# EAGLE design RedBot (EAGLE 6.5.0)
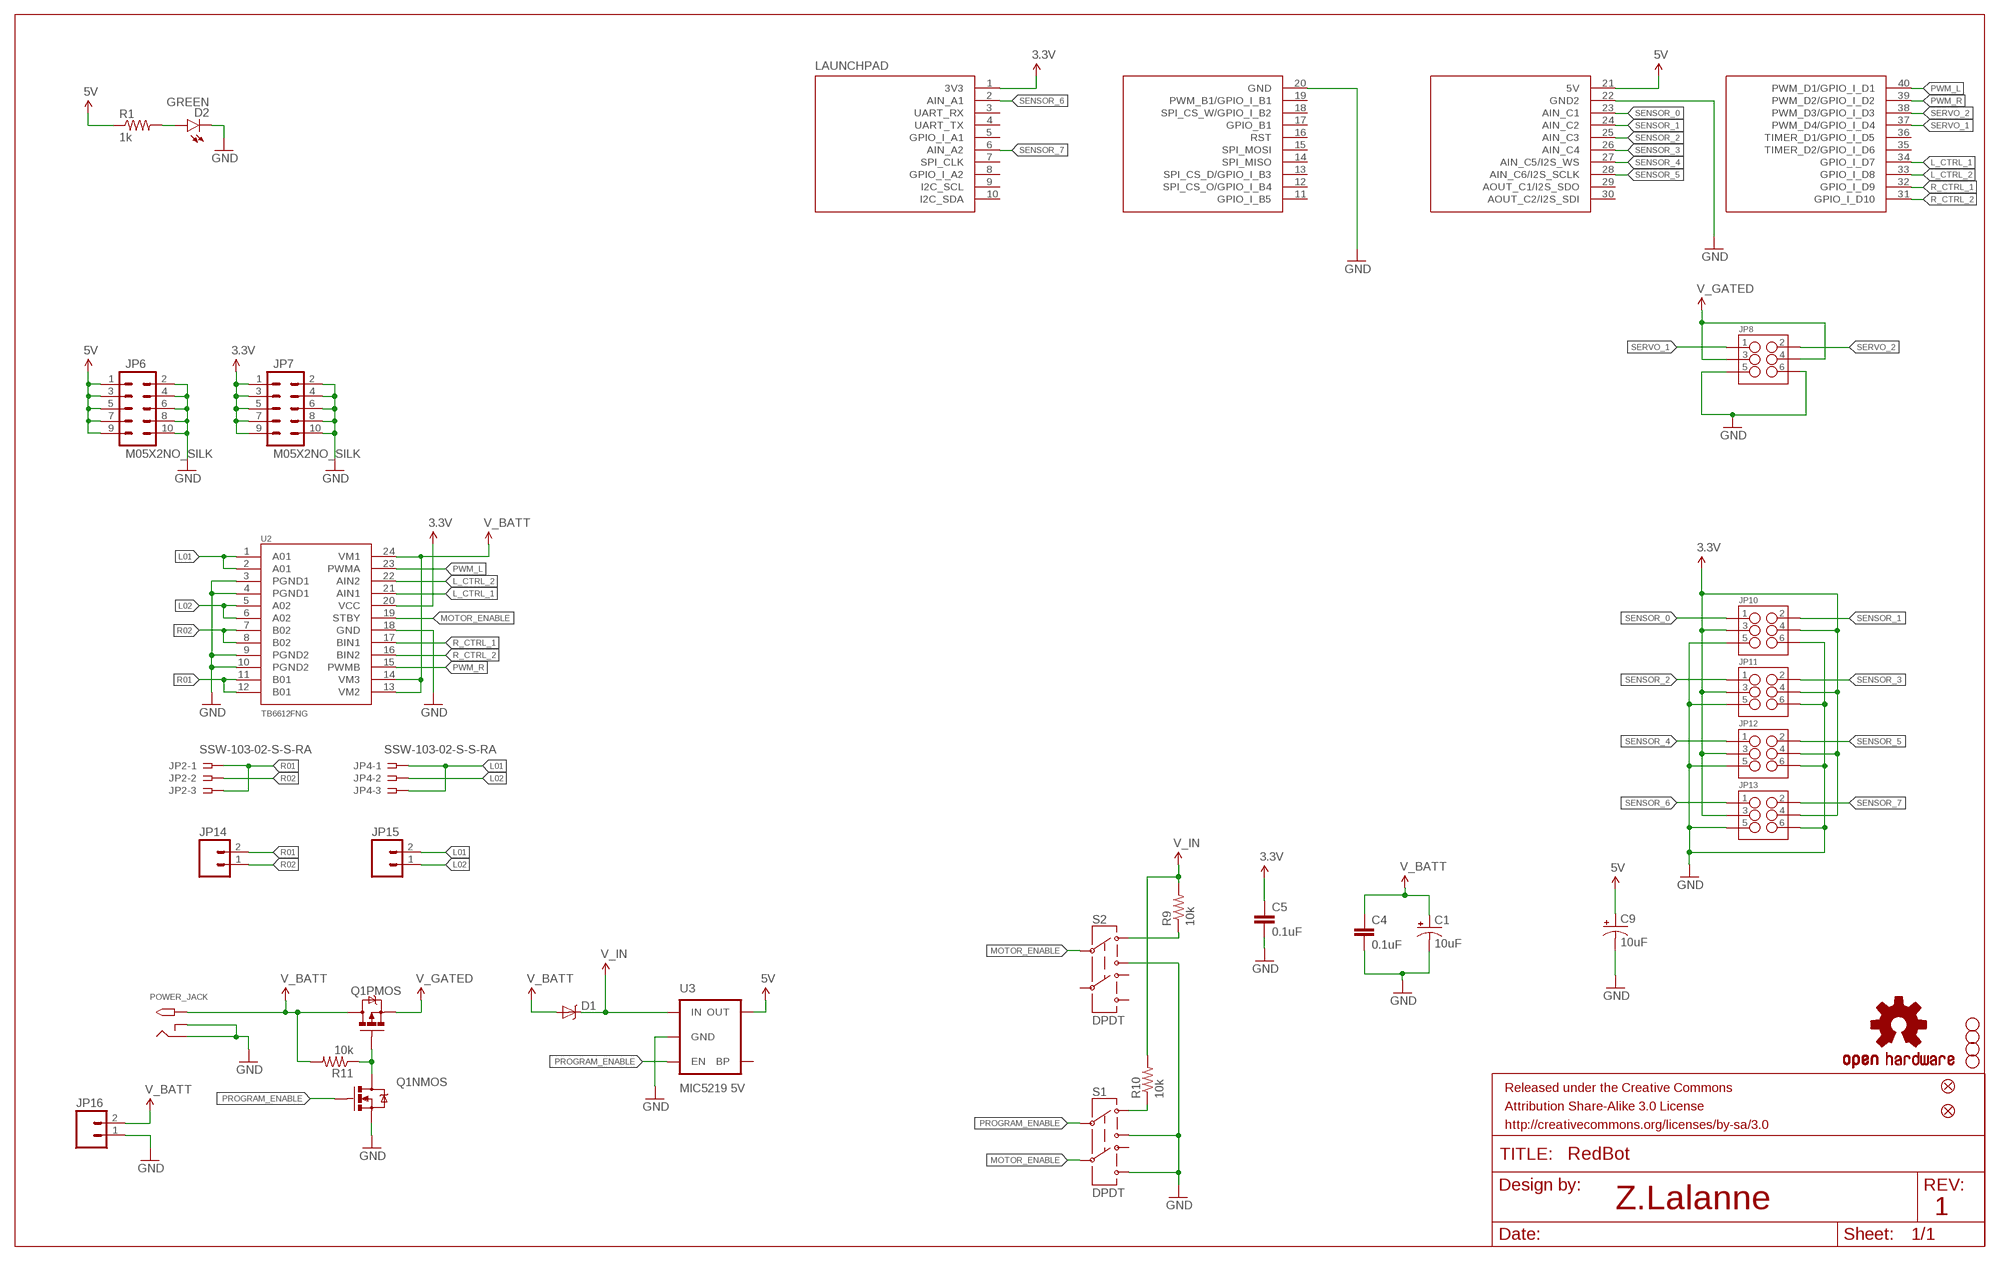
[diagram p0: schematic, sheet 1]

## Parts
C1  10uF  10UF-16V-10%(TANT)  [EIA3216]
C4  0.1uF  CAP1206  [1206]
C5  0.1uF  CAP1206  [1206]
C9  10uF  10UF-16V-10%(TANT)  [EIA3216]
D1  B340A  [SMA-DIODE]
D2  GREEN  LED-GREENLARGE  [LED-1206]
FID1  FIDUCIALUFIDUCIAL  [MICRO-FIDUCIAL]
FID2  FIDUCIALUFIDUCIAL  [MICRO-FIDUCIAL]
FRAME1  FRAME-LETTER  [CREATIVE_COMMONS]
JP2  SSW-103-02-S-S-RA  [SSW-103-02-S-S-RA]
JP4  SSW-103-02-S-S-RA  [SSW-103-02-S-S-RA]
JP6  M05X2NO_SILK  [2X5_NOSILK]
JP7  M05X2NO_SILK  [2X5_NOSILK]
JP8  M03X22X3_SILK_SM  [2X3]
JP10  M03X22X3_SILK_SM  [2X3]
JP11  M03X22X3_SILK_SM  [2X3]
JP12  M03X22X3_SILK_SM  [2X3]
JP13  M03X22X3_SILK_SM  [2X3]
JP14  M02PTH  [1X02]
JP15  M02PTH  [1X02]
JP16  M02PTH  [1X02]
LAUNCHPAD  BOOSTERPACK  [BOOSTERPACK40]
POWER_JACK  2.1MMJACKTHM  [PJ-102A]
Q1  IRF7509  [MSOP8]
R1  1k  RESISTOR1206  [1206]
R9  10k  RESISTOR1206  [1206]
R10  10k  RESISTOR1206  [1206]
R11  10k  RESISTOR1206  [1206]
S1  DPDT  SWITCH-DPDTAYZ0202  [AYZ0202]
S2  DPDT  SWITCH-DPDTAYZ0202  [AYZ0202]
STANDOFF1  STAND-OFF  [STAND-OFF]
STANDOFF2  STAND-OFF  [STAND-OFF]
STANDOFF3  STAND-OFF  [STAND-OFF]
STANDOFF4  STAND-OFF  [STAND-OFF]
U2  TB6612FNG  TB6621FNG  [SSOP24]
U3  MIC5219 5V  V_REG_MIC52195V  [SOT23-5]
U$17  OSHW-LOGOS  [OSHW-LOGO-S]

## Nets
3.3V: C5.1 JP7.1 JP7.3 JP7.5 JP7.7 JP7.9 JP10.3 JP10.4 JP11.3 JP11.4 JP12.3 JP12.4 JP13.3 JP13.4 LAUNCHPAD.1(3V3) U2.20(VCC)
5V: C9.A(+) JP6.1 JP6.3 JP6.5 JP6.7 JP6.9 LAUNCHPAD.21(5V) R1.1 U3.5(OUT)
GND: C1.C(-) C4.2 C5.2 C9.C(-) D2.C JP6.2 JP6.4 JP6.6 JP6.8 JP6.10 JP7.2 JP7.4 JP7.6 JP7.8 JP7.10 JP8.5 JP8.6 JP10.5 JP10.6 JP11.5 JP11.6 JP12.5 JP12.6 JP13.5 JP13.6 JP16.1 LAUNCHPAD.20(GND) LAUNCHPAD.22(GND2) POWER_JACK.RING POWER_JACK.RING_SW Q1.1(NMOS:S) S1.3 S1.6 S2.3 U2.3(PGND1) U2.4(PGND1) U2.9(PGND2) U2.10(PGND2) U2.18(GND) U3.2(GND)
L01: JP4.1 JP4.3 JP15.2 U2.1(A01) U2.2(A01)
L02: JP4.2 JP15.1 U2.5(A02) U2.6(A02)
L_CTRL_1: LAUNCHPAD.34(GPIO_I_D7) U2.21(AIN1)
L_CTRL_2: LAUNCHPAD.33(GPIO_I_D8) U2.22(AIN2)
MOTOR_ENABLE: S1.5 S2.2 U2.19(STBY)
N$1: D2.A R1.2
N$2: Q1.4(PMOS:G) Q1.7(NMOS:D) Q1.8(NMOS:D) R11.1
N$18: R9.1 S2.1
PG_EN: R10.1 S1.1
PROGRAM_ENABLE: Q1.2(NMOS:G) S1.2 U3.3(EN)
PWM_L: LAUNCHPAD.40(PWM_D1/GPIO_I_D1) U2.23(PWMA)
PWM_R: LAUNCHPAD.39(PWM_D2/GPIO_I_D2) U2.15(PWMB)
R01: JP2.1 JP2.3 JP14.2 U2.11(B01) U2.12(B01)
R02: JP2.2 JP14.1 U2.7(B02) U2.8(B02)
R_CTRL_1: LAUNCHPAD.32(GPIO_I_D9) U2.17(BIN1)
R_CTRL_2: LAUNCHPAD.31(GPIO_I_D10) U2.16(BIN2)
SENSOR_0: JP10.1 LAUNCHPAD.23(AIN_C1)
SENSOR_1: JP10.2 LAUNCHPAD.24(AIN_C2)
SENSOR_2: JP11.1 LAUNCHPAD.25(AIN_C3)
SENSOR_3: JP11.2 LAUNCHPAD.26(AIN_C4)
SENSOR_4: JP12.1 LAUNCHPAD.27(AIN_C5/I2S_WS)
SENSOR_5: JP12.2 LAUNCHPAD.28(AIN_C6/I2S_SCLK)
SENSOR_6: JP13.1 LAUNCHPAD.2(AIN_A1)
SENSOR_7: JP13.2 LAUNCHPAD.6(AIN_A2)
SERVO_1: JP8.1 LAUNCHPAD.37(PWM_D4/GPIO_I_D4)
SERVO_2: JP8.2 LAUNCHPAD.38(PWM_D3/GPIO_I_D3)
V_BATT: C1.A(+) C4.1 D1.A JP16.2 POWER_JACK.TIP Q1.5(PMOS:D) Q1.6(PMOS:D) R11.2 U2.13(VM2) U2.14(VM3) U2.24(VM1)
V_GATED: JP8.3 JP8.4 Q1.3(PMOS:S)
V_IN: D1.C R9.2 R10.2 U3.1(IN)
Unconnected: LAUNCHPAD.3(UART_RX) LAUNCHPAD.4(UART_TX) LAUNCHPAD.5(GPIO_I_A1) LAUNCHPAD.7(SPI_CLK) LAUNCHPAD.8(GPIO_I_A2) LAUNCHPAD.9(I2C_SCL) LAUNCHPAD.10(I2C_SDA) LAUNCHPAD.11(GPIO_I_B5) LAUNCHPAD.12(SPI_CS_O/GPIO_I_B4) LAUNCHPAD.13(SPI_CS_D/GPIO_I_B3) LAUNCHPAD.14(SPI_MISO) LAUNCHPAD.15(SPI_MOSI) LAUNCHPAD.16(RST) LAUNCHPAD.17(GPIO_B1) LAUNCHPAD.18(SPI_CS_W/GPIO_I_B2) LAUNCHPAD.19(PWM_B1/GPIO_I_B1) LAUNCHPAD.29(AOUT_C1/I2S_SDO) LAUNCHPAD.30(AOUT_C2/I2S_SDI) LAUNCHPAD.35(TIMER_D2/GPIO_I_D6) LAUNCHPAD.36(TIMER_D1/GPIO_I_D5) S1.4 S2.4 S2.5 S2.6 U3.4(BP)

## Notes on the sheet
- Z.Lalanne | 1

## Library data of the parts
C1 C9 = SparkFun-Capacitors:10UF-16V-10%(TANT): CAP-00811 1206/EIA-3216 Tantalum capacitor; PROD_ID: CAP-00811
C4 C5 = SparkFun-Capacitors:CAP: Capacitor Standard 0603 ceramic capacitor, and 0.1" leaded capacitor.
D1 = SparkFun-DiscreteSemi:B340A: Schottky Diode 3A-40V; PROD_ID: DIO-09886
D2 = SparkFun-LED:LED-GREEN: Various green LEDs Green LEDs used in SFE Production 0603- DIO-00821 LARGE- DIO-00862 LILYPAD- DIO-09910; PROD_ID: DIO-00862
FID1 FID2 = SparkFun-Aesthetics:FIDUCIAL: Fiducial Alignment Points Various fiducial points for machine vision alignment.
FRAME1 = SparkFun-Aesthetics:FRAME-LETTER: Schematic Frame Standard 8.5x11 US Letter frame
JP2 JP4 = con-samtec:SSW-103-02-S-S: THROUGH-HOLE .025" SQ POST SOCKET Source: Samtec SSW.pdf; MPN: SSW-103-02-S-S-RA; OC_FARNELL: unknown; OC_NEWARK: 11P9368
JP6 JP7 = SparkFun-Connectors:M05X2: Header 5x2 Standard 10-pin dual row 0.1" header. Commonly used with AVR-ISP. Use with Spark Fun Electronics SKU: PRT-00778
JP8 JP10-JP13 = SparkFun-Connectors:M03X2: 2x3 .1" header. Shrouded, with keying- CONN-10681 SMT- CONN-11415 Pogo pins- HW-11044
JP14-JP16 = SparkFun-Connectors:M02: Header 2 Standard 2-pin 0.1" header. Use with straight break away headers (SKU : PRT-00116), right angle break away headers (PRT-00553), swiss pins (PRT-00743), machine pins (PRT-00117), and female headers (PRT-00115). Molex polarized connector foot print use with SKU : PRT-08233 with associated crimp pins and housings.
LAUNCHPAD = zlalanne:BOOSTERPACK
POWER_JACK = adafruit:2.1MMJACK: 2.1mm x 5.5mm THM DC jack with internal switch. Digikey part #PJ-102A, 4UCON part #05537 2.1mm x 5.5mm SMT DC jack with internal switch. Digikey part #PJ-002A-SMT, 4UCON part #03267 By microbuilder.eu & adafruit.com
Q1 = SparkFun-DiscreteSemi:IRF7509: 30V Dual PMOS/NMOS MSOP-8 NMOS RDS .11-ohm PMOS RDS .20-ohm TRANS-07913; PROD_ID: TRANS-07913
R1 R9-R11 = SparkFun-Resistors:RESISTOR: Resistor Basic schematic elements and footprints for 0603, 1206, and PTH resistors.
S1 S2 = SparkFun-Electromechanical:SWITCH-DPDT: DPDT Version of the COM-00597; PROD_ID: SWCH-08179
STANDOFF1-STANDOFF4 = SparkFun-Electromechanical:STAND-OFF: #4 Stand Off This is the mechanical footprint for a #4 phillips button head screw. Use the keepout ring to avoid running the screw head into surrounding components. SKU : PRT-00447
U2 = SparkFun-PowerIC:TB6621FNG: Toshiba 1A dual motor driver IC-09363; PROD_ID: IC-09363
U3 = SparkFun-PowerIC:V_REG_MIC5219: V_REG MIC5219 Standard 500mA LDO voltage regulator in SOT-23 layout. Micrel part MIC5219. BP (by-pass) pin is used to lower output noise with 470pF cap, may be left open.; PROD_ID: VREG-10107
U$17 = SparkFun-Aesthetics:OSHW-LOGO: Open Source Hardware Logo This logo indicates the piece of hardware it is found on incorporates a OSHW license and/or adheres to the definition of open source hardware found here: http://freedomdefined.org/OSHW

## Board
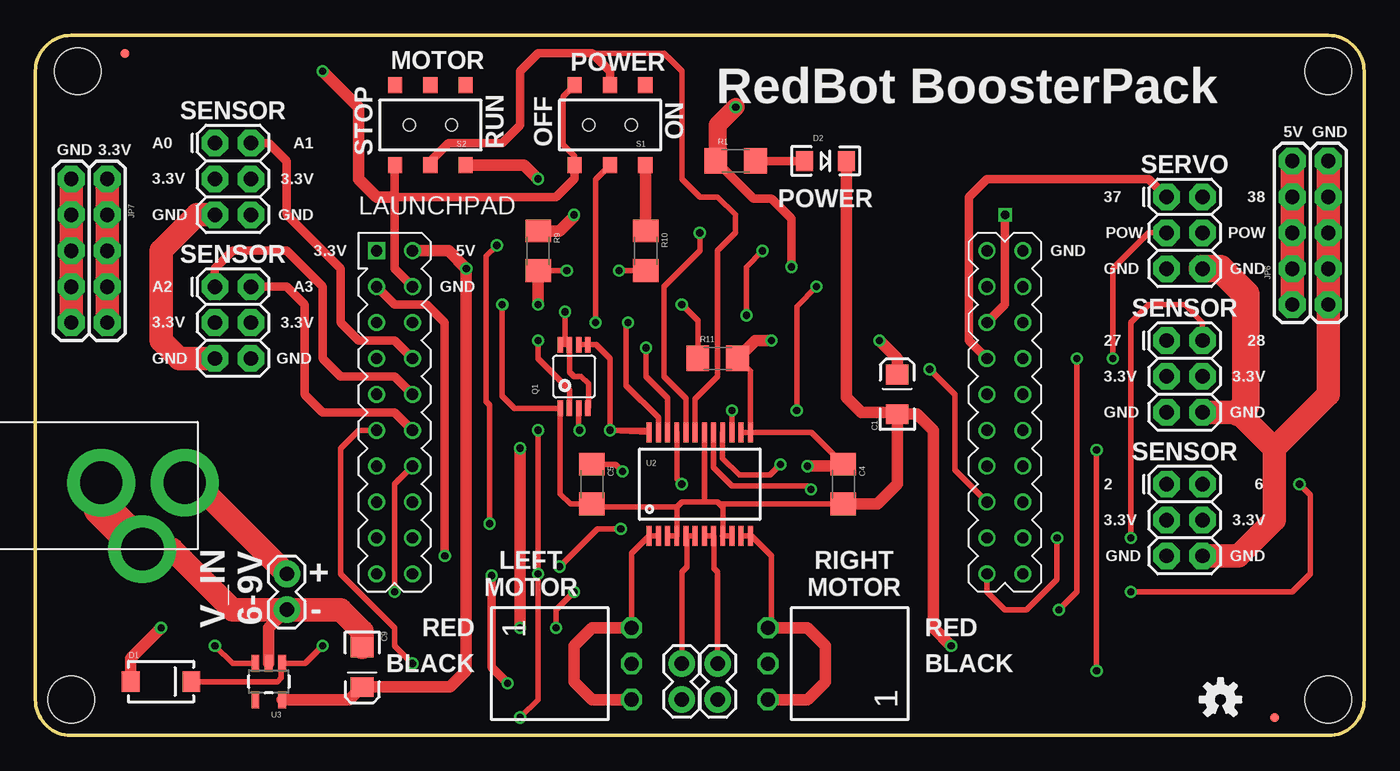
[diagram p1: board, top side]
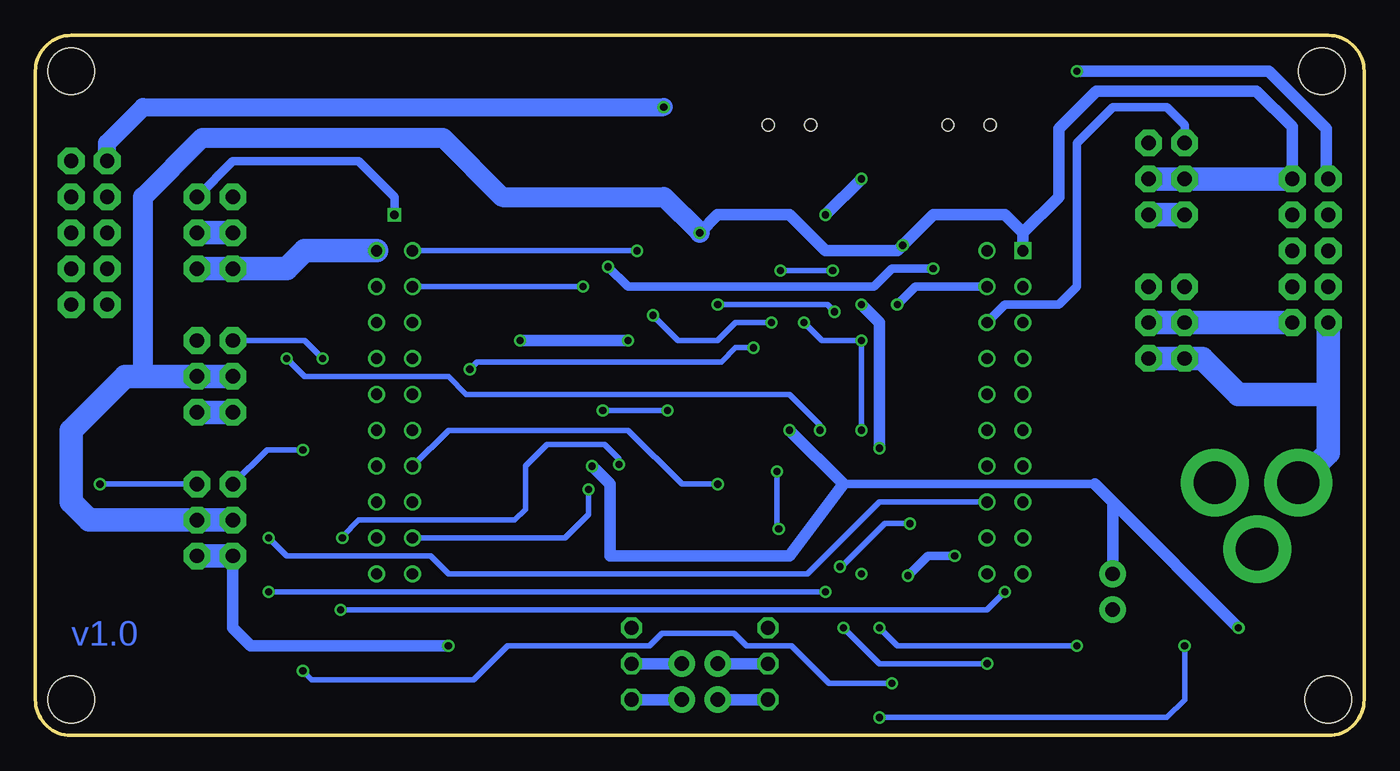
[diagram p2: board, bottom side, seen from below]

Size 93.98 x 49.53 mm. Coordinates in mm from the lower left corner, seen from the top.
Outline: 0,46.99 0,2.54 arc90 2.54,0 91.44,0 arc90 93.98,2.54 93.98,46.99 arc90 91.44,49.53 2.54,49.53 arc90 0,46.99
Copper layers (1*16): Top 0.0356mm / dielectric 1.5011mm / Bottom 0.0356mm
Design rules "LaenPCBOrder": minimum track width 6mil, minimum drill 13mil, track to track 6mil, track to pad 6mil, pad to pad 6mil, via to via 6mil, smd to smd 6mil, copper to edge 15mil, drill to drill 6mil, minimum pad ring 7mil, minimum via ring 7mil, stop-mask expansion 3mil, vias tented up to drill 0mil, thermal gap 10mil

### Footprints (pad centres in the part's own frame; a part is rotated, then mirrored left to right if it is on the bottom)
EIA3216 = smd 1.4 x 1.6: A 1.4,0; C -1.4,0
1206 = smd 1.6 x 1.8: 1 -1.4,0; 2 1.4,0
SMA-DIODE = smd 1.27 x 1.47: A -2.15,0; C 2.15,0
LED-1206 = smd 1.2 x 1.4: A -1.5,0; C 1.5,0
MICRO-FIDUCIAL = smd 0.635 x 0.635: 1 0,0
SSW-103-02-S-S-RA = drill 1 pad 1.5 octagon: 1 -2.54,1.524; 2 0,1.524; 3 2.54,1.524
2X5_NOSILK = drill 1.016 pad 1.88 octagon: 1 -1.27,5.08; 2 1.27,5.08; 3 -1.27,2.54; 4 1.27,2.54; 5 -1.27,0; 6 1.27,0; 7 -1.27,-2.54; 8 1.27,-2.54; 9 -1.27,-5.08; 10 1.27,-5.08
2X3 = drill 1.016 pad 1.88 octagon: 1 0,0; 2 0,2.54; 3 2.54,0; 4 2.54,2.54; 5 5.08,0; 6 5.08,2.54
1X02 = drill 1.016 pad 1.88: 1 0,0; 2 2.54,0
BOOSTERPACK40 = drill 0.8 square: 1 -22.86,11.43 | drill 0.8: 2 -22.86,8.89; 3 -22.86,6.35; 4 -22.86,3.81; 5 -22.86,1.27; 6 -22.86,-1.27; 7 -22.86,-3.81; 8 -22.86,-6.35; 9 -22.86,-8.89; 10 -22.86,-11.43; 11 22.86,-11.43; 12 22.86,-8.89; 13 22.86,-6.35; 14 22.86,-3.81; 15 22.86,-1.27; 16 22.86,1.27; 17 22.86,3.81; 18 22.86,6.35; 19 22.86,8.89; 20 22.86,11.43; 21 -20.32,11.43; 22 -20.32,8.89; 23 -20.32,6.35; 24 -20.32,3.81; 25 -20.32,1.27; 26 -20.32,-1.27; 27 -20.32,-3.81; 28 -20.32,-6.35; 29 -20.32,-8.89; 30 -20.32,-11.43; 31 20.32,-11.43; 32 20.32,-8.89; 33 20.32,-6.35; 34 20.32,-3.81; 35 20.32,-1.27; 36 20.32,1.27; 37 20.32,3.81; 38 20.32,6.35; 39 20.32,8.89; 40 20.32,11.43
PJ-102A = drill 3 pad 4.8: RING 0.1,-3.39; RING_SW -4.6,-6.29; TIP 0.1,-9.29
MSOP8 = smd 0.4 x 1.1: 1 -0.975,-2.25; 2 -0.325,-2.25; 3 0.325,-2.25; 4 0.975,-2.25; 5 0.975,2.25; 6 0.325,2.25; 7 -0.325,2.25; 8 -0.975,2.25
AYZ0202 = smd 1 x 1.15: 1 -2.5,2.825; 2 0,2.825; 3 2.5,2.825; 4 -2.5,-2.825; 5 0,-2.825; 6 2.5,-2.825 | hole 0.85: 1.5,0; -1.5,0
STAND-OFF = hole 3.302: 0,0
SSOP24 = smd 0.348 x 1.397: 1 -3.575,-3.656; 2 -2.925,-3.656; 3 -2.275,-3.656; 4 -1.625,-3.656; 5 -0.975,-3.656; 6 -0.325,-3.656; 7 0.325,-3.656; 8 0.975,-3.656; 9 1.625,-3.656; 10 2.275,-3.656; 11 2.925,-3.656; 12 3.575,-3.656; 13 3.575,3.656; 14 2.925,3.656; 15 2.275,3.656; 16 1.625,3.656; 17 0.975,3.656; 18 0.325,3.656; 19 -0.325,3.656; 20 -0.975,3.656; 21 -1.625,3.656; 22 -2.275,3.656; 23 -2.925,3.656; 24 -3.575,3.656
SOT23-5 = smd 0.55 x 1.2: 1 -0.95,-1.3; 2 0,-1.3; 3 0.95,-1.3; 4 0.95,1.3; 5 -0.95,1.3

### Placement (x,y rotation side)
C1  60.96,24.13 90 top
C4  57.15,17.78 270 top
C5  39.37,17.78 270 top
C9  23.11,4.83 270 top
D1  8.89,3.81 0 top
D2  55.88,40.64 0 top
FID1  6.35,48.26 0 top
FID2  87.63,1.27 0 top
FRAME1  19.05,-11.43 0 top  (outside the outline)
JP2  53.34,5.08 90 top
JP4  40.64,5.08 270 top
JP6  90.17,35.56 0 top
JP7  3.81,34.29 180 top
JP8  80.01,38.1 270 top
JP10  12.7,41.91 270 top
JP11  12.7,31.75 270 top
JP12  80.01,27.94 270 top
JP13  80.01,17.78 270 top
JP14  48.26,5.08 270 top
JP15  45.72,5.08 270 top
JP16  17.78,8.89 90 top
LAUNCHPAD  46.99,22.86 0 top
POWER_JACK  1.27,17.78 90 top
Q1  38.1,25.4 0 top
R1  49.53,40.64 0 top
R9  35.56,34.29 270 top
R10  43.18,34.29 270 top
R11  48.26,26.67 0 top
S1  40.64,43.18 180 top
S2  27.94,43.18 180 top
STANDOFF1  91.44,2.54 0 top
STANDOFF2  2.99,46.99 0 top
STANDOFF3  2.54,2.54 0 top
STANDOFF4  91.44,46.99 0 top
U2  46.99,17.78 0 top
U3  16.51,3.81 180 top
U$17  83.82,2.54 0 top

### Tracks (layer width: path | path; a pad name or v marks a point on that pad's centre or on a via)
3.3V  (via drill 0.51)
  Top 0.406: v46.99,35.56 46.99,34.29 44.45,31.75 44.45,25.4 46.02,23.84 U2.20 | C5.1 41.02,19.18 v41.53,18.67 | v41.4,14.61 39.75,14.61 v37.08,11.94 | v32.13,14.99 32.13,23.37 31.88,23.62 31.88,33.91 v32.64,34.67
  Top 1.676: JP7.9 JP7.7 JP7.5 JP7.3 JP7.1
  Bottom 0.406: v41.53,18.67 41.53,14.73 v41.4,14.61 | v37.08,11.94 36.96,11.94 33.91,14.99 v32.13,14.99
  Bottom 0.813: LAUNCHPAD.1 24.13,35.56 | 24.13,35.56 25.4,36.83 30.48,36.83 31.75,35.56 v32.64,34.67 33.02,34.29 38.1,34.29 40.64,36.83 45.72,36.83 v46.99,35.56 | 24.13,35.56 21.59,38.1 21.59,42.93 18.92,45.59 7.62,45.59 5.08,43.05 JP7.9
  Bottom 1.422: 86.36,25.4 86.36,38.1 82.17,42.29 65.15,42.29 60.96,38.1 49.53,38.1 v46.99,35.56
  Bottom 1.676: JP13.3 JP13.4 90.17,15.24 91.44,16.51 91.44,21.59 87.63,25.4 86.36,25.4 JP12.4 JP12.3 | JP11.4 JP11.3 JP7.1 | JP10.4 JP10.3 JP7.9
5V  (via drill 0.51)
  Top 0.61: v53.47,33.15 53.47,36.58 52.07,37.97 50.8,37.97 R1.1
  Top 0.813: U3.5 22.2,2.51 C9.A 29.34,3.43 30.48,4.57 v30.48,33.02 29.21,34.29 LAUNCHPAD.21
  Top 1.27: v49.53,44.45 48.26,43.18 48.26,40.77 R1.1
  Top 1.676: JP6.1 JP6.3 JP6.5 JP6.7 JP6.9
  Bottom 0.61: v30.48,33.02 33.4,33.02 34.67,31.75 52.07,31.75 v53.47,33.15
  Bottom 1.27: JP6.1 88.9,41.91 86.36,44.45 v49.53,44.45
GND  (via drill 0.51)
  Top 0.406: U2.3 U2.4 45.37,16.16 | U2.10 U2.9 48.64,14.15 48.64,16.13 48.39,16.38 | 45.37,16.16 45.72,16.51 47.24,16.51 | 47.24,16.51 48.26,16.51 48.39,16.38 | U2.18 47.31,16.58 47.24,16.51 | 45.37,16.16 39.59,16.16 C5.2 37.85,16.38 37.12,17.1 Q1.1 37.09,23.11 33.91,23.11 33.02,24 v33.02,30.48 | C4.2 48.39,16.38 | S1.3 38.14,40.98 37.34,41.78 37.34,45.2 S1.6
  Top 0.61: LAUNCHPAD.22 25.4,33.02 25.4,38.1 | 25.4,38.1 25.4,40.31 S2.3 | S1.3 38.14,39.41 36.83,38.1 25.4,38.1
  Top 0.813: U3.2 16.51,7.62 JP16.1 | C4.2 59.56,16.38 60.96,17.78 C1.C | C1.C 62.36,22.73 63.5,21.59 63.5,7.62 v64.77,6.35 | D2.C 57.38,23.9 58.42,22.86 60.83,22.86 C1.C | 25.4,38.1 24.13,38.1 22.86,39.37 22.86,44.45 v20.32,46.99
  Top 1.676: JP6.2 JP6.4 JP6.6 JP6.8 | JP6.8 JP6.10 | JP7.10 JP7.8 JP7.6 JP7.4 JP7.2 | JP13.6 85.09,12.7 87.63,15.24 87.63,20.32 | 87.63,20.32 85.09,22.86 JP12.6 | JP6.8 91.44,24.13 87.63,20.32 | JP10.5 11.43,36.83 8.89,34.29 8.89,27.94 10.16,26.67 JP11.5 | POWER_JACK.RING_SW 9.68,13.18 13.97,8.89 JP16.1 21.59,8.89 23.11,7.37 C9.C
  Top 1.93: JP8.6 83.82,33.02 85.6,31.24 85.6,23.37 85.09,22.86
  Top 2.54: POWER_JACK.RING 4.66,16.08 POWER_JACK.RING_SW
  Bottom 0.61: LAUNCHPAD.22 31.75,31.75 v33.02,30.48
  Bottom 0.813: v64.77,6.35 78.74,6.35 80.01,7.62 JP13.5 | v20.32,46.99 6.73,46.99 2.67,42.93 2.67,39.5 JP7.10
  Bottom 1.676: JP13.5 JP13.6 | JP12.5 JP12.6 | JP8.6 JP8.5 76.2,33.02 74.93,34.29 LAUNCHPAD.20 | JP11.5 JP11.6 11.43,26.67 8.89,24.13 2.54,24.13 | JP10.5 JP10.6 | JP7.2 2.54,24.13 | 2.54,24.13 2.54,20 POWER_JACK.RING
L01
  Top 0.406: JP4.1 42.16,12.87 U2.1 U2.2
  Top 0.813: JP4.1 39.37,7.62 38.1,6.35 38.1,3.81 39.37,2.54 JP4.3
  Bottom 0.813: JP4.3 JP15.2
L02
  Top 0.406: JP15.1 45.72,11.56 46.1,11.94 46.1,14.04 U2.5 U2.6
  Bottom 0.813: JP4.2 JP15.1
L_CTRL_1  (via drill 0.51)
  Top 0.406: U2.21 45.37,18.14 v45.72,17.78
  Bottom 0.406: v45.72,17.78 48.26,17.78 52.07,21.59 64.77,21.59 LAUNCHPAD.34
L_CTRL_2  (via drill 0.51)
  Top 0.406: U2.22 44.72,23.86 43.18,25.4 v43.18,27.43 | v63.25,25.91 65.02,24.13 65.02,18.8 LAUNCHPAD.33
  Bottom 0.406: v43.18,27.43 44.45,27.43 45.47,26.42 62.74,26.42 v63.25,25.91
MOTOR_ENABLE
  Top 0.406: U2.19 46.66,23.8 48.26,25.4 48.26,34.29 49.53,35.56 49.53,36.83 48.26,38.1 46.99,38.1 45.72,39.37 45.72,46.99 44.45,48.26 39.37,48.26
  Top 0.61: S1.5 40.64,46.99 39.37,48.26 35.56,48.26 34.29,46.99 34.29,43.18 33.02,41.91 29.21,41.91 27.94,40.64 S2.2
N$1
  Top 0.61: D2.A R1.2
N$2  (via drill 0.51)
  Top 0.406: Q1.8 Q1.7 | Q1.7 37.77,25.73 38.1,25.4 38.61,25.4 39.12,24.89 39.12,23.19 Q1.4 | R11.1 46.86,29.34 v45.72,30.48 | v37.47,29.97 37.47,27.96 Q1.7
  Bottom 0.406: v45.72,30.48 37.97,30.48 v37.47,29.97
N$18  (via drill 0.51)
  Top 0.813: S2.1 34.58,40.35 v35.56,39.37 | v38.1,36.83 38.1,36.7 37.08,35.69 R9.1
  Bottom 0.813: v35.56,39.37 v38.1,36.83
PG_EN
  Top 0.813: S1.1 43.14,35.73 R10.1
PROGRAM_ENABLE  (via drill 0.51)
  Top 0.406: Q1.2 37.77,24.45 35.56,26.67 v35.56,27.94 | v39.62,29.21 39.62,39.34 S1.2 | U3.3 13.94,5.11 v12.7,6.35 | v35.56,21.59 v35.56,11.43 35.56,2.54 v34.29,1.27
  Bottom 0.406: v39.62,29.21 38.35,27.94 v35.56,27.94 v35.56,21.59 | v34.29,1.27 13.97,1.27 12.7,2.54 v12.7,6.35
PWM_L  (via drill 0.51)
  Top 0.406: U2.23 44.06,22.48 41.78,24.77 41.78,29.08 v41.91,29.21 | v50.29,29.72 50.29,33.15 v51.44,34.29
  Bottom 0.406: v41.91,29.21 44.45,29.21 45.72,27.94 48.51,27.94 v50.29,29.72 | v51.44,34.29 LAUNCHPAD.40
PWM_R  (via drill 0.51)
  Top 0.406: U2.15 49.27,22.98 v49.28,22.99 | v53.85,22.99 53.85,30.35 v55.24,31.75
  Bottom 0.406: v49.28,22.99 v53.85,22.99 | v55.24,31.75 LAUNCHPAD.39
R01
  Top 0.406: U2.11 U2.12 50.65,14.12 52.07,12.7 52.07,7.87 JP2.3
  Top 0.813: JP2.3 54.61,7.62 55.88,6.35 55.88,3.81 54.61,2.54 JP2.1
  Bottom 0.813: JP2.1 JP14.2
R02
  Top 0.406: JP14.1 48.26,11.56 48.01,11.81 48.01,14.08 U2.8 U2.7
  Bottom 0.813: JP14.1 JP2.2
R_CTRL_1  (via drill 0.51)
  Top 0.406: U2.17 47.97,18.96 49.28,17.65 54.61,17.65 v54.86,17.4
  Bottom 0.406: v54.86,17.4 54.86,15.62 56.52,13.97 LAUNCHPAD.32
R_CTRL_2  (via drill 0.51)
  Top 0.406: U2.16 48.62,19.58 49.78,18.41 51.94,18.41 v52.7,19.18 | v72.26,13.97 72.26,11.05 70.1,8.89 68.58,8.89 67.31,10.16 LAUNCHPAD.31
  Bottom 0.406: v52.7,19.18 52.7,19.56 53.72,20.57 57.78,20.57 59.31,19.05 59.31,16 60.07,15.24 71.12,15.24 72.26,14.1 v72.26,13.97
SENSOR_0
  Bottom 0.61: LAUNCHPAD.23 25.4,30.48 21.59,30.48 20.32,31.75 20.32,41.91 17.78,44.45 13.97,44.45 12.7,43.18 JP10.1
SENSOR_1
  Top 0.61: LAUNCHPAD.24 25.4,27.94 22.86,27.94 21.59,29.21 21.59,33.02 17.78,36.83 17.78,40.64 16.51,41.91 JP10.2
SENSOR_2
  Top 0.61: JP11.1 12.7,33.02 13.97,34.29 17.78,34.29 20.32,31.75 20.32,26.67 21.59,25.4 25.4,25.4 LAUNCHPAD.25
SENSOR_3
  Top 0.61: JP11.2 17.78,31.75 19.05,30.48 19.05,24.13 20.32,22.86 25.4,22.86 LAUNCHPAD.26
SENSOR_4  (via drill 0.51)
  Top 0.406: v73.66,26.67 73.66,10.16 v72.39,8.89 | v25.4,10.16 25.4,17.78 LAUNCHPAD.27
  Bottom 0.406: JP12.1 74.93,27.94 v73.66,26.67 | v72.39,8.89 26.67,8.89 v25.4,10.16
SENSOR_5  (via drill 0.51)
  Top 0.406: v77.47,13.97 77.47,29.21 78.74,30.48 81.28,30.48 82.55,29.21 JP12.2
  Bottom 0.406: LAUNCHPAD.28 34.29,16.51 39.37,11.43 64.77,11.43 66.04,12.7 76.2,12.7 v77.47,13.97
SENSOR_6  (via drill 0.51)
  Top 0.406: v75.06,4.57 v75.06,20.19
  Top 0.61: LAUNCHPAD.2 25.4,30.48 27.69,30.48 28.96,29.21 v28.96,12.7 | v32.26,11.3 32.26,4.83 v33.4,3.68
  Bottom 0.406: v33.4,3.68 37.85,3.68 40.51,6.35 43.69,6.35 44.58,7.24 49.66,7.24 50.55,6.35 60.58,6.35 62.99,3.94 74.42,3.94 v75.06,4.57 | v75.06,20.19 77.6,20.19 JP13.1
  Bottom 0.61: v28.96,12.7 30.86,12.7 v32.26,11.3
SENSOR_7  (via drill 0.51)
  Top 0.406: LAUNCHPAD.6 22.86,21.59 21.59,20.32 21.59,11.43 25.4,7.62 25.4,6.35 v26.67,5.08 | v77.47,10.16 88.9,10.16 90.17,11.43 90.17,17.02 v89.41,17.78 | v36.83,7.62 36.83,8.89 v38.1,10.16
  Bottom 0.406: v26.67,5.08 34.29,5.08 v36.83,7.62 | v38.1,10.16 v77.47,10.16 | v89.41,17.78 JP13.2
SERVO_1
  Top 0.61: LAUNCHPAD.37 66.04,27.94 66.04,38.1 67.31,39.37 78.74,39.37 JP8.1
SERVO_2  (via drill 0.6)
  Top 0.61: LAUNCHPAD.38 68.58,30.48 v68.58,36.83
  Bottom 0.61: v68.58,36.83 68.58,38.1 71.12,40.64 80.01,40.64 JP8.2
V_BATT  (via drill 0.51)
  Top 0.406: U2.13 U2.14 | U2.13 50.56,25.77 R11.2 | Q1.6 Q1.5 39.66,27.65 40.64,26.67 v40.64,21.59 | v40.64,21.59 43.26,21.59 U2.24 v40.64,21.59 | U2.13 54.89,21.44 C4.1
  Top 0.813: D1.A 6.74,5.47 v8.89,7.62 | C1.A 60.96,26.67 v59.69,27.94 | v52.07,27.94 50.93,27.94 R11.2 | v54.61,19.05 57.02,19.05 C4.1
  Top 1.676: POWER_JACK.TIP 11.33,17.88 JP16.2
  Bottom 0.61: 19.05,17.78 36.83,17.78
  Bottom 0.813: v8.89,7.62 17.78,16.51 | 17.78,16.51 19.05,17.78 | v40.64,21.59 36.83,17.78 40.64,12.7 53.34,12.7 53.34,17.78 v54.61,19.05 | JP16.2 17.78,16.51 | v59.69,27.94 v52.07,27.94
V_GATED  (via drill 0.51)
  Top 0.406: Q1.3 38.42,21.65 v38.48,21.59 | v76.2,26.67 76.2,33.02 78.74,35.56 JP8.3
  Bottom 0.406: v38.48,21.59 38.48,21.97 40.64,24.13 63.5,24.13 64.77,25.4 74.93,25.4 v76.2,26.67
  Bottom 1.676: JP8.3 JP8.4
V_IN  (via drill 0.51)
  Top 0.406: D1.C 17.14,3.81 17.4,4.06 17.4,5.05 U3.1 19.08,5.11 v20.32,6.35 | R9.2 v37.59,32.89 | v41.27,32.89 R10.2
  Top 0.813: v34.29,7.62 v34.29,20.32 | v35.56,30.48 R9.2
  Bottom 0.406: v20.32,6.35 33.02,6.35 v34.29,7.62 | v37.59,32.89 v41.27,32.89
  Bottom 0.813: v34.29,20.32 34.29,29.21 v35.56,30.48

### Text on the board
Bottom: v1.0
tPlace: MOTOR | POWER | RedBot BoosterPack | SENSOR | A0 | A1 | RUN | OFF | ON | 5V | GND | GND | 3.3V | STOP | SERVO | 3.3V | 3.3V | POWER | 37 | 38 | GND | GND | POW | POW | 3.3V | 5V | GND | SENSOR | GND | GND | A2 | A3 | GND | SENSOR | 3.3V | 3.3V | 27 | 28 | GND | GND | 3.3V | 3.3V | GND | GND | SENSOR | 2 | 6 | 3.3V | 3.3V | GND | GND | + | LEFT / MOTOR | RIGHT / MOTOR | V_IN / 6-9V | - | RED | RED | BLACK | BLACK